# EAGLE design logic (EAGLE 6.4)
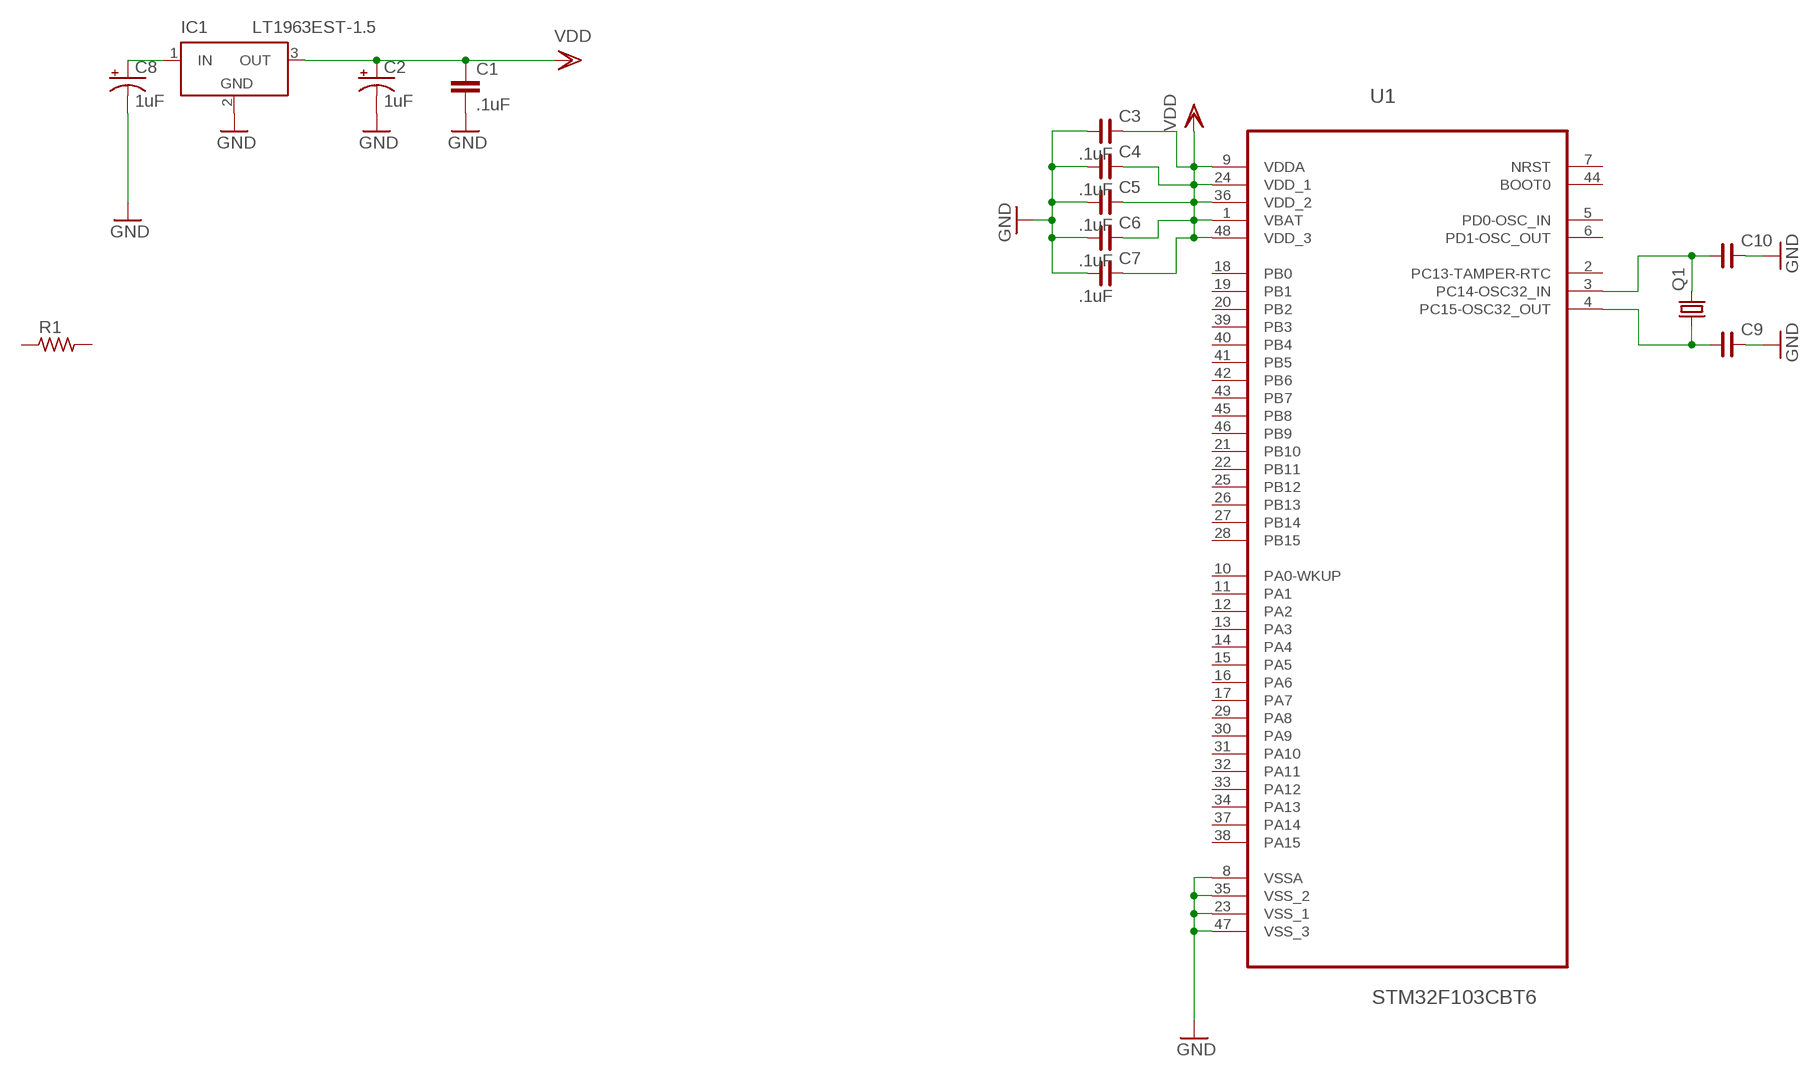
[diagram p0: schematic, sheet 1]

## Parts
C1  .1uF  C-EUC0603  [C0603]
C2  1uF  CPOL-USD/7343-31R  [D/7343-31R]
C3  .1uF  C_0402  [C0402]
C4  .1uF  C_0402  [C0402]
C5  .1uF  C_0402  [C0402]
C6  .1uF  C_0402  [C0402]
C7  .1uF  C_0402  [C0402]
C8  1uF  CPOL-USD/7343-31R  [D/7343-31R]
C9  C_0402  [C0402]
C10  C_0402  [C0402]
IC1  LT1963EST-1.5  [SOT223]
Q1  CRYSTALTC26H  [TC26H]
R1  R_0402  [R0402]
U1  STM32F103CBT6  [QFP50P900X900X160-48N]

## Nets
GND: C1.2 C2.- C3.1 C4.1 C5.1 C6.1 C7.1 C8.- C9.2 C10.2 IC1.2(GND) U1.8(VSSA) U1.23(VSS_1) U1.35(VSS_2) U1.47(VSS_3)
N$1: C10.1 Q1.2 U1.3(PC14-OSC32_IN)
N$2: C9.1 Q1.1 U1.4(PC15-OSC32_OUT)
N$3: C8.+ IC1.1(IN)
VDD: C1.1 C2.+ C3.2 C4.2 C5.2 C6.2 C7.2 IC1.3(OUT) U1.1(VBAT) U1.9(VDDA) U1.24(VDD_1) U1.36(VDD_2) U1.48(VDD_3)
Unconnected: R1.1 R1.2 U1.2(PC13-TAMPER-RTC) U1.5(PD0-OSC_IN) U1.6(PD1-OSC_OUT) U1.7(NRST) U1.10(PA0-WKUP) U1.11(PA1) U1.12(PA2) U1.13(PA3) U1.14(PA4) U1.15(PA5) U1.16(PA6) U1.17(PA7) U1.18(PB0) U1.19(PB1) U1.20(PB2) U1.21(PB10) U1.22(PB11) U1.25(PB12) U1.26(PB13) U1.27(PB14) U1.28(PB15) U1.29(PA8) U1.30(PA9) U1.31(PA10) U1.33(PA12) U1.34(PA13) U1.37(PA14) U1.38(PA15) U1.39(PB3) U1.40(PB4) U1.41(PB5) U1.42(PB6) U1.43(PB7) U1.44(BOOT0) U1.45(PB8) U1.46(PB9)

## Power pins joined to a net without a drawn wire
GND: IC1.4(GND)
PA11: U1.32(PA11)

## Library data of the parts
C1 = rcl:C-EU: CAPACITOR, European symbol
C2 C8 = rcl:CPOL-US: POLARIZED CAPACITOR, American symbol
C3-C7 C9 C10 = rc-master:C_: NON-POLARIZED CAP
IC1 = linear-technology:LT1963EST: 1.5A, Low Noise, Fast Transient Response LDO Regulator Source: http://www.linear.com/pc/downloadDocument.do?navId=H0,C3,P2222,D3148; MPN: LT1963EST-1.5; OC_FARNELL: 1663528; OC_NEWARK: 57M7534
Q1 = adafruit:CRYSTAL: CRYSTAL; OC_FARNELL: unknown; OC_NEWARK: unknown
R1 = rc-master:R_: RESISTOR
U1 = ST Microelctronics_By_element14_Batch_1:STM32F103CBT6: Medium-density performance line ARM-based 32-bit MCU; MPN: STM32F103CBT6; OC_FARNELL: 1606327; OC_NEWARK: 11N8296; PACKAGE: QFP-48; SUPPLIER: STMICROELECTRONICS

## Board
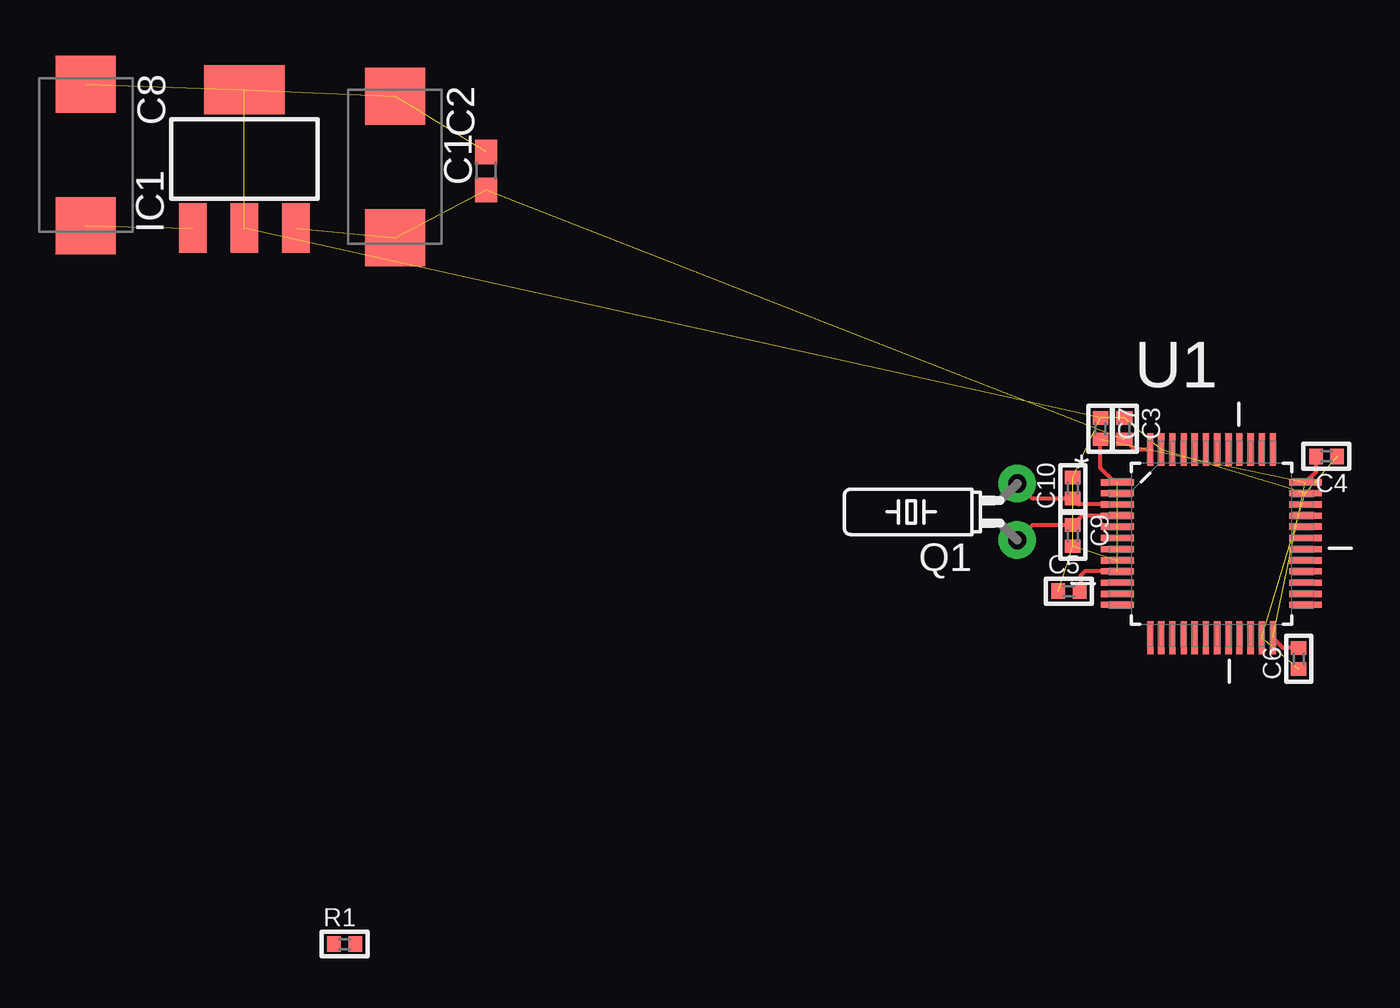
[diagram p1: board, top side]

No outline drawn. Coordinates in mm, seen from the top.
Copper layers (1*16): Top 0.035mm / dielectric 1.5mm / Bottom 0.035mm
Design rules "default": minimum track width 10mil, minimum drill 24mil, track to track 8mil, track to pad 8mil, pad to pad 8mil, via to via 8mil, smd to smd 8mil, copper to edge 40mil, drill to drill 8mil, minimum pad ring 10mil, minimum via ring 8mil, stop-mask expansion 4mil, vias tented up to drill 0mil, thermal gap 10mil

### Footprints (pad centres in the part's own frame; a part is rotated, then mirrored left to right if it is on the bottom)
C0603 = smd 1.1 x 1: 1 -0.85,0; 2 0.85,0
D/7343-31R = smd 2.55 x 2.7: + 3.175,0; - -3.175,0
C0402 = smd 0.6 x 0.7: 1 -0.476,0; 2 0.476,0
SOT223 = smd 1.219 x 2.235: 1 -2.311,-3.099; 2 0,-3.099; 3 2.311,-3.099 | smd 3.6 x 2.2: 4 0,3.099
TC26H = drill 0.813 pad 1.676: 1 -1.27,0; 2 1.27,0
R0402 = smd 0.6 x 0.7: 1 -0.476,0; 2 0.476,0
QFP50P900X900X160-48N = smd 1.473 x 0.279: 1 -4.216,2.743; 2 -4.216,2.261; 3 -4.216,1.753; 4 -4.216,1.245; 5 -4.216,0.762; 6 -4.216,0.254; 7 -4.216,-0.254; 8 -4.216,-0.762; 9 -4.216,-1.245; 10 -4.216,-1.753; 11 -4.216,-2.261; 12 -4.216,-2.743; 25 4.216,-2.743; 26 4.216,-2.261; 27 4.216,-1.753; 28 4.216,-1.245; 29 4.216,-0.762; 30 4.216,-0.254; 31 4.216,0.254; 32 4.216,0.762; 33 4.216,1.245; 34 4.216,1.753; 35 4.216,2.261; 36 4.216,2.743 | smd 0.279 x 1.473: 13 -2.743,-4.216; 14 -2.261,-4.216; 15 -1.753,-4.216; 16 -1.245,-4.216; 17 -0.762,-4.216; 18 -0.254,-4.216; 19 0.254,-4.216; 20 0.762,-4.216; 21 1.245,-4.216; 22 1.753,-4.216; 23 2.261,-4.216; 24 2.743,-4.216; 37 2.743,4.216; 38 2.261,4.216; 39 1.753,4.216; 40 1.245,4.216; 41 0.762,4.216; 42 0.254,4.216; 43 -0.254,4.216; 44 -0.762,4.216; 45 -1.245,4.216; 46 -1.753,4.216; 47 -2.261,4.216; 48 -2.743,4.216

### Placement (x,y rotation side)
C1  -7.11,29.34 90 top
C2  -11.2,29.51 270 top
C3  21.51,17.78 270 top
C4  30.58,16.54 180 top
C5  19.02,10.49 0 top
C6  29.34,7.47 90 top
C7  20.45,17.78 270 top
C8  -25.07,30.05 270 top
C9  19.2,12.98 270 top
C10  19.2,15.11 90 top
IC1  -17.96,29.87 0 top
Q1  16.71,14.05 90 top
R1  -13.46,-5.33 0 top
U1  25.43,12.62 0 top

### Tracks (layer width: path | path; a pad name or v marks a point on that pad's centre or on a via)
GND  (15 unrouted)
N$1
  Top 0.178: U1.3 19.46,14.38 C10.1 17.39,14.64 Q1.2
N$2
  Top 0.178: U1.4 19.61,13.87 C9.1 17.39,13.46 Q1.1
N$3  (1 unrouted)
VDD  (7 unrouted)
  Top 0.178: U1.9 19.74,11.38 19.56,11.2 19.56,10.55 C5.2 | U1.1 21.08,15.37 20.45,16 C7.2 | U1.48 21.98,16.84 C3.2 | C4.2 30.11,15.83 U1.36 | C6.2 28.63,7.94 U1.24